# EAGLE design GW Alarm-v2 (EAGLE 6.6.0)
AUTHOR: Steven O'Shea; COMPANY: IGR; DATE: 2019-10-08; DESCRIPTION: Gravitational Wave Detection Alarm System; REVISION: 2019-10-08; TITLE: GW ALARM

## Sheet 1 of 4
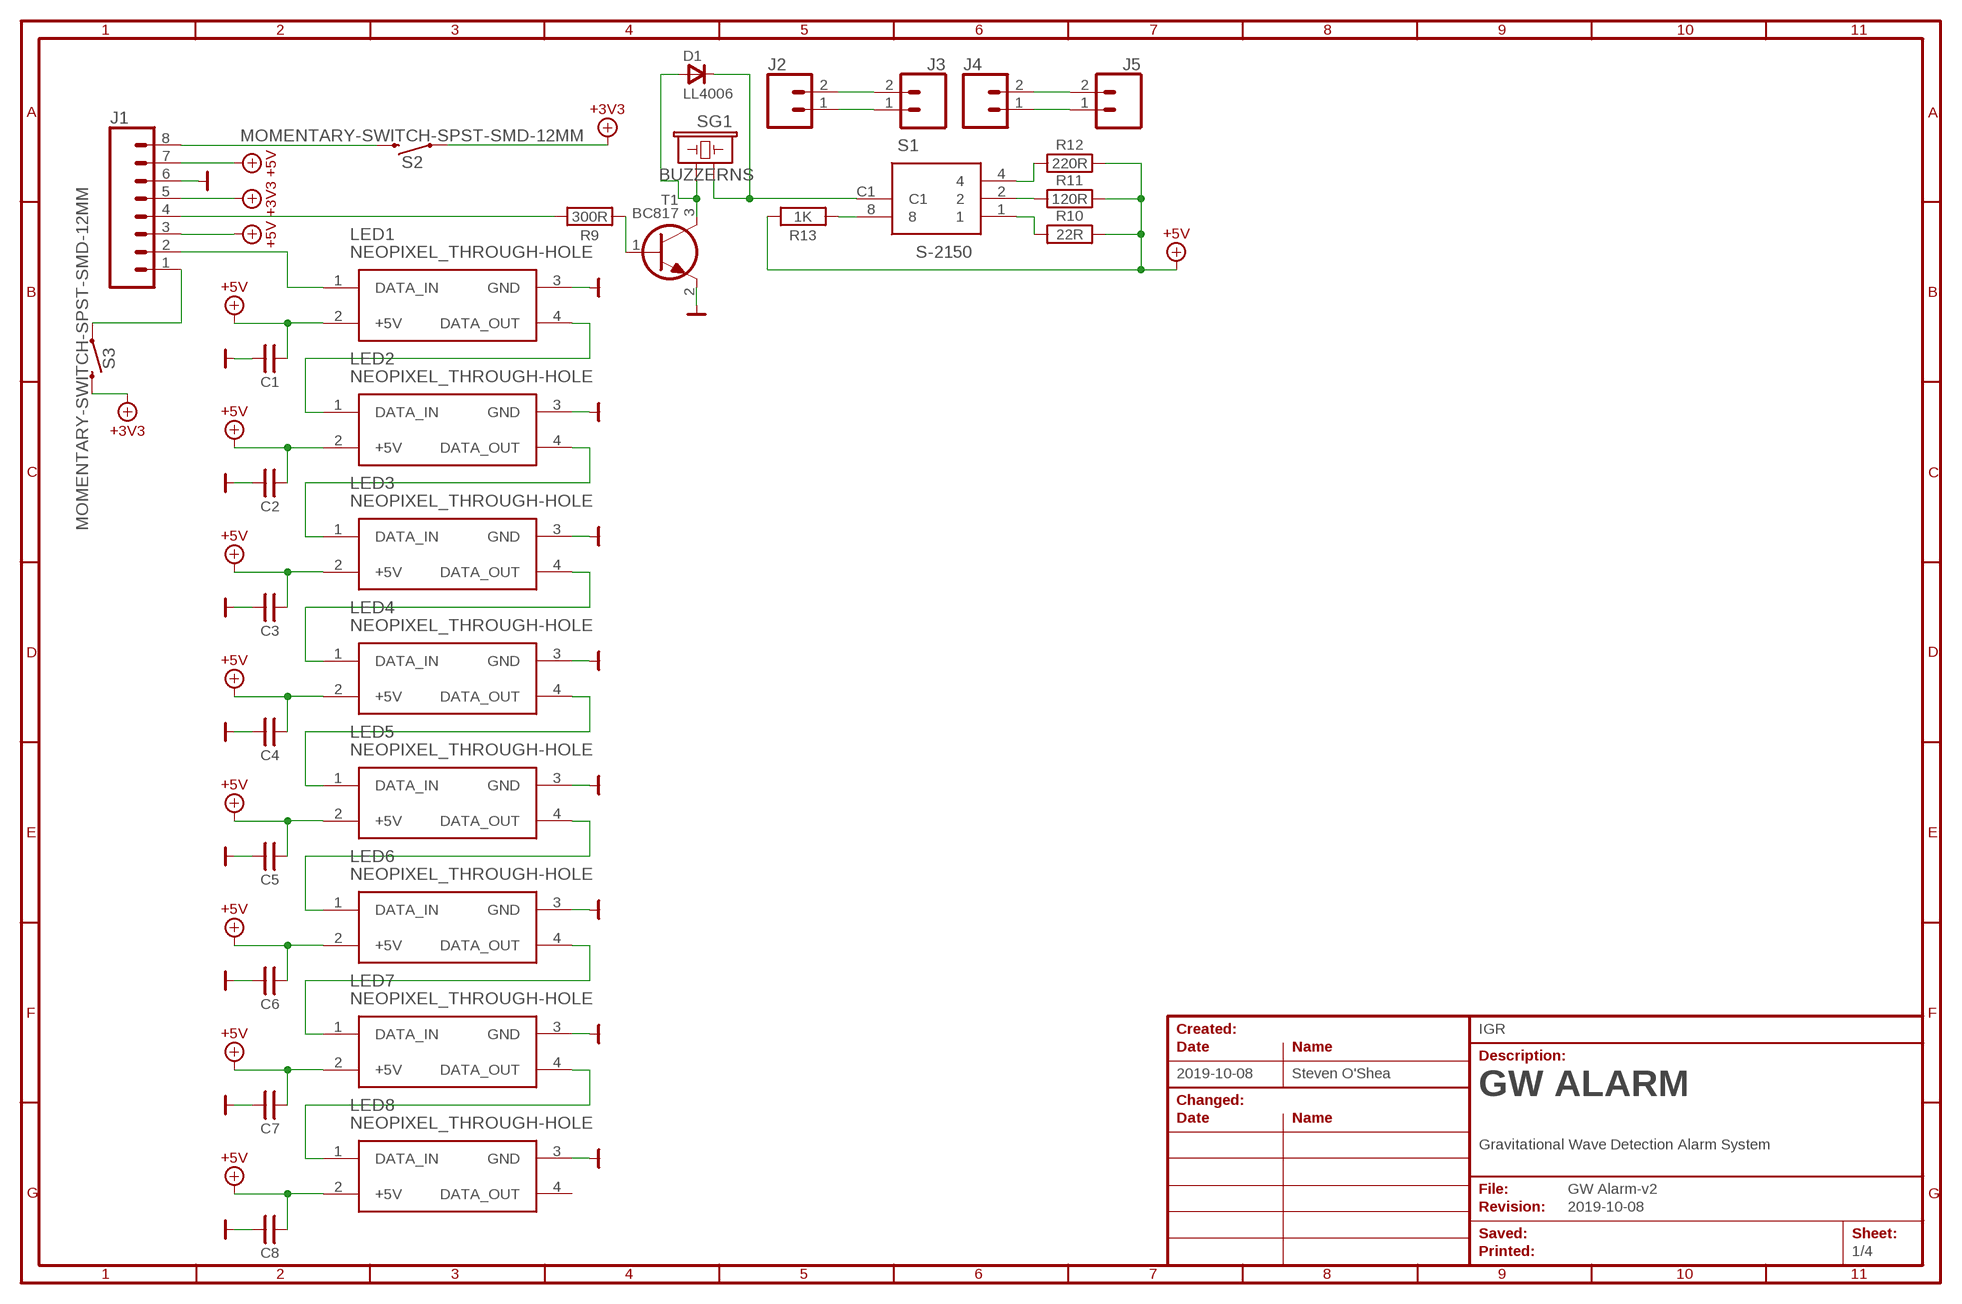
[diagram p0: schematic, sheet 1]
$1 (FRAME-A4-LANDSCAPE): SPICE: <ignore>

### Parts
C1  C1206  [C1206]
C2  C1206  [C1206]
C3  C1206  [C1206]
C4  C1206  [C1206]
C5  C1206  [C1206]
C6  C1206  [C1206]
C7  C1206  [C1206]
C8  C1206  [C1206]
D1  LL4006  DMELF  [DMELF-VALUE]
J1  CONN_083.5MM-8  [SCREWTERMINAL-3.5MM-8]
J2  CONN_023.5MM  [SCREWTERMINAL-3.5MM-2]
J3  CONN_02LOCK_LONGPADS  [1X02_LOCK_LONGPADS]
J4  CONN_023.5MM  [SCREWTERMINAL-3.5MM-2]
J5  CONN_02LOCK_LONGPADS  [1X02_LOCK_LONGPADS]
LED1  NEOPIXEL_THROUGH-HOLE  [NEOPIXEL_THROUGH-HOLE]
LED2  NEOPIXEL_THROUGH-HOLE  [NEOPIXEL_THROUGH-HOLE]
LED3  NEOPIXEL_THROUGH-HOLE  [NEOPIXEL_THROUGH-HOLE]
LED4  NEOPIXEL_THROUGH-HOLE  [NEOPIXEL_THROUGH-HOLE]
LED5  NEOPIXEL_THROUGH-HOLE  [NEOPIXEL_THROUGH-HOLE]
LED6  NEOPIXEL_THROUGH-HOLE  [NEOPIXEL_THROUGH-HOLE]
LED7  NEOPIXEL_THROUGH-HOLE  [NEOPIXEL_THROUGH-HOLE]
LED8  NEOPIXEL_THROUGH-HOLE  [NEOPIXEL_THROUGH-HOLE]
R9  300R  R1206  [R1206]
R10  22R  R1206  [R1206]
R11  120R  R1206  [R1206]
R12  220R  R1206  [R1206]
R13  1K  R1206  [R1206]
S1  S-2150  [S2150]
S2  MOMENTARY-SWITCH-SPST-SMD-12MM  [TACTILE_SWITCH_SMD_12MM]
S3  MOMENTARY-SWITCH-SPST-SMD-12MM  [TACTILE_SWITCH_SMD_12MM]
SG1  BUZZERNS  [BUZZER-12MM-NS]
T1  BC817  BC817S  [SOT23]

### Nets
+3V3: J1.5 S2.1 S3.3 ; supply symbol labelled V+3V3
+5V: C1.1 C2.1 C3.1 C4.1 C5.1 C6.1 C7.1 C8.1 J1.3 J1.7 LED1.2(+5V) LED2.2(+5V) LED3.2(+5V) LED4.2(+5V) LED5.2(+5V) LED6.2(+5V) LED7.2(+5V) LED8.2(+5V) R10.2 R11.2 R12.2 R13.2 ; supply symbol labelled V+5V
GND: C1.2 C2.2 C3.2 C4.2 C5.2 C6.2 C7.2 C8.2 J1.6 LED1.3(GND) LED2.3(GND) LED6.3(GND) LED8.3(GND) T1.2(E) ; supply symbol labelled VG
N$1: D1.A SG1.- T1.3(C)
N$2: R9.1 T1.1(B)
N$3: R10.1 S1.1
N$4: R11.1 S1.2
N$5: R12.1 S1.4
N$6: R13.1 S1.8
N$7: LED1.4(DATA_OUT) LED2.1(DATA_IN)
N$8: LED2.4(DATA_OUT) LED3.1(DATA_IN)
N$9: LED3.4(DATA_OUT) LED4.1(DATA_IN)
N$10: LED4.4(DATA_OUT) LED5.1(DATA_IN)
N$11: LED5.4(DATA_OUT) LED6.1(DATA_IN)
N$12: LED6.4(DATA_OUT) LED7.1(DATA_IN)
N$13: LED7.4(DATA_OUT) LED8.1(DATA_IN)
N$14: J1.2 LED1.1(DATA_IN)
N$16: J1.4 R9.2
N$22: D1.C S1.C1 SG1.+
N$24: J1.1 S3.1
N$26: J1.8 S2.3
N$28: J2.1 J3.1
N$29: J2.2 J3.2
N$30: J4.1 J5.1
N$31: J4.2 J5.2
Unconnected: LED8.4(DATA_OUT)

## Sheet 2 of 4
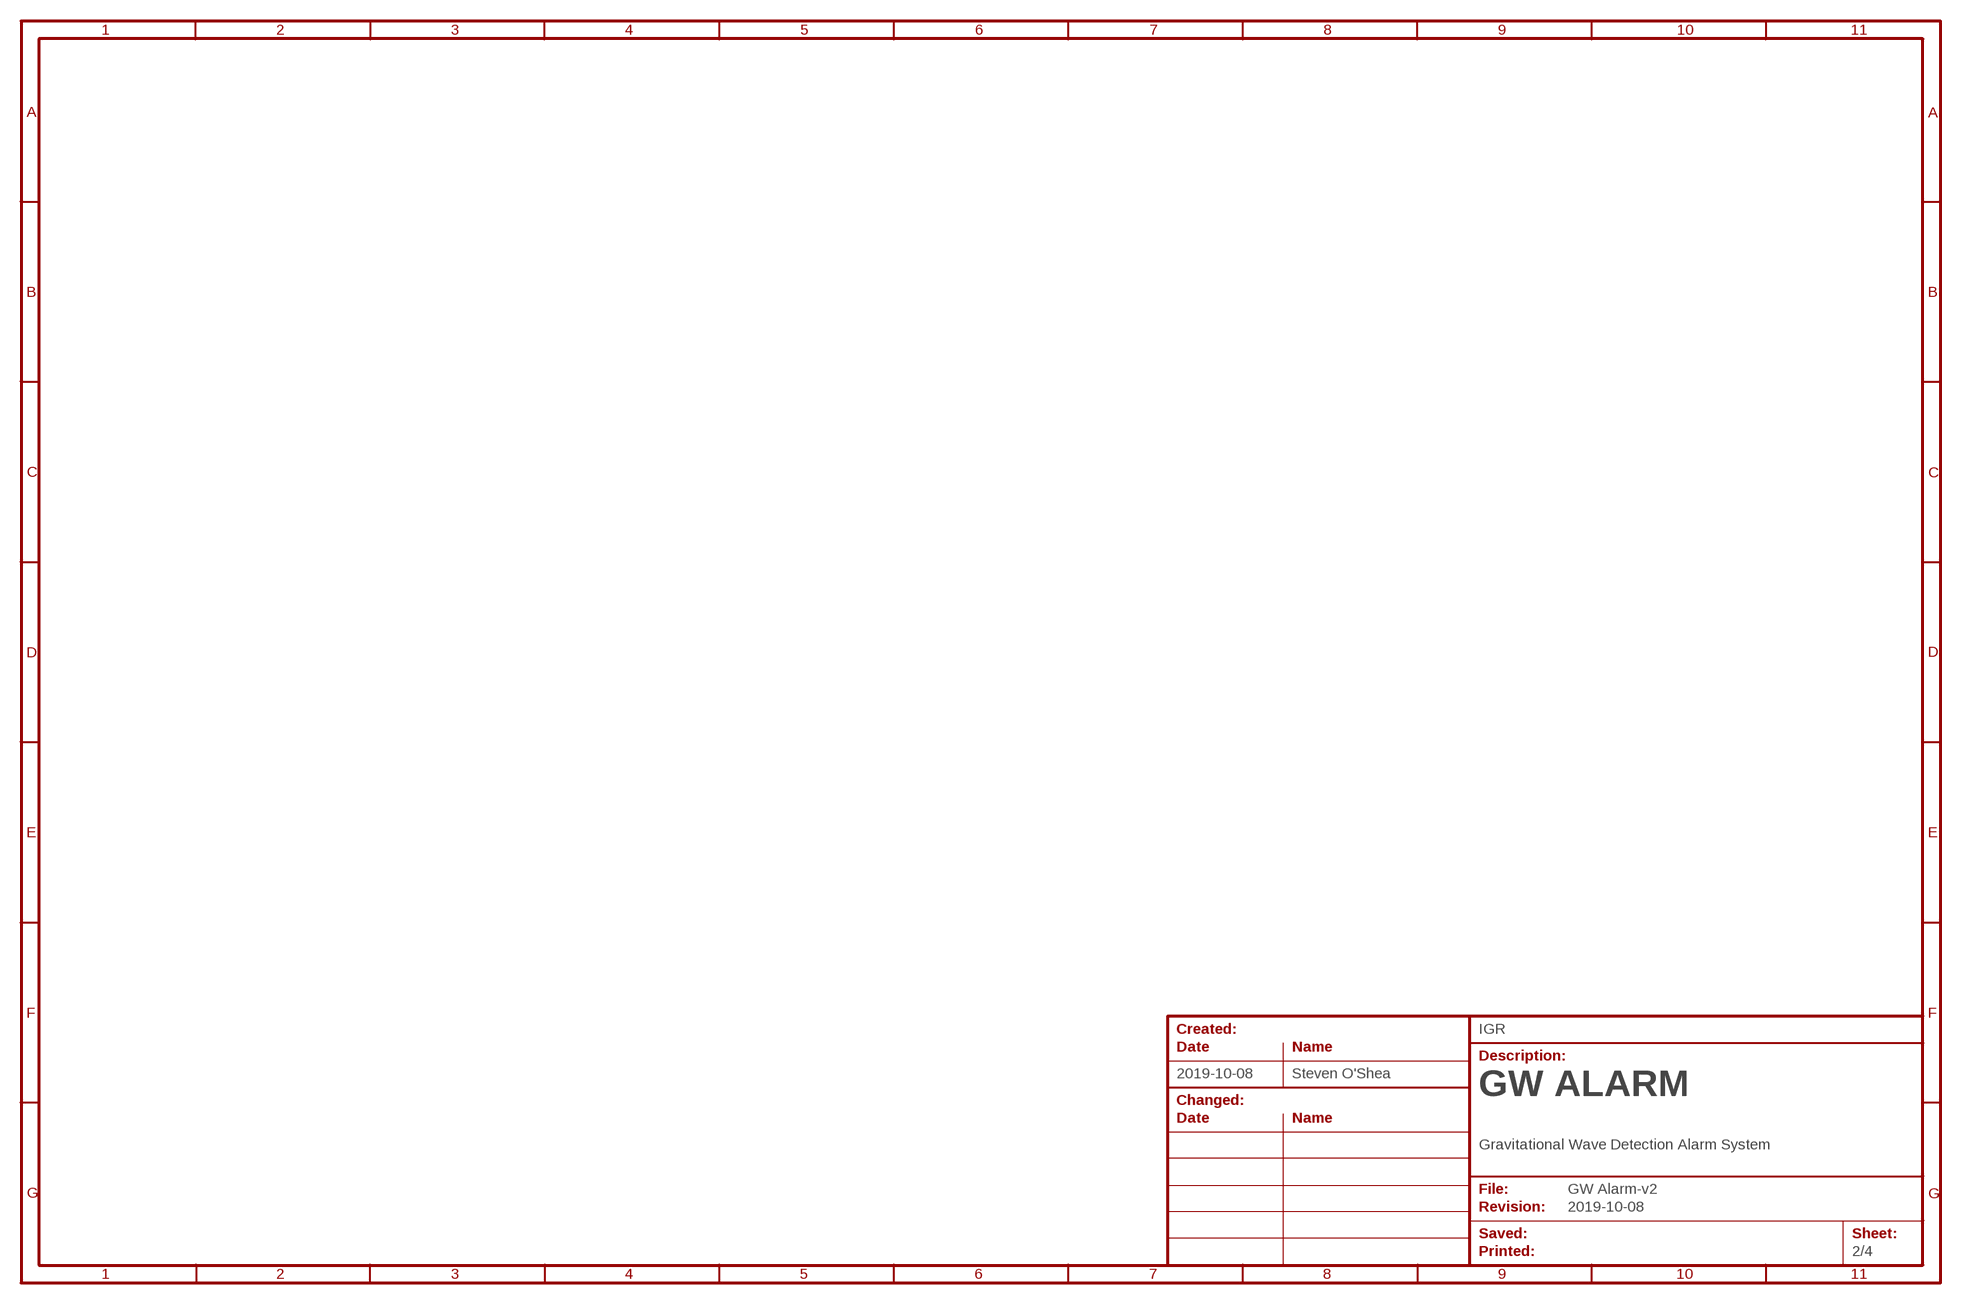
[diagram p1: schematic, sheet 2]
$2 (FRAME-A4-LANDSCAPE): SPICE: <ignore>

## Sheet 3 of 4
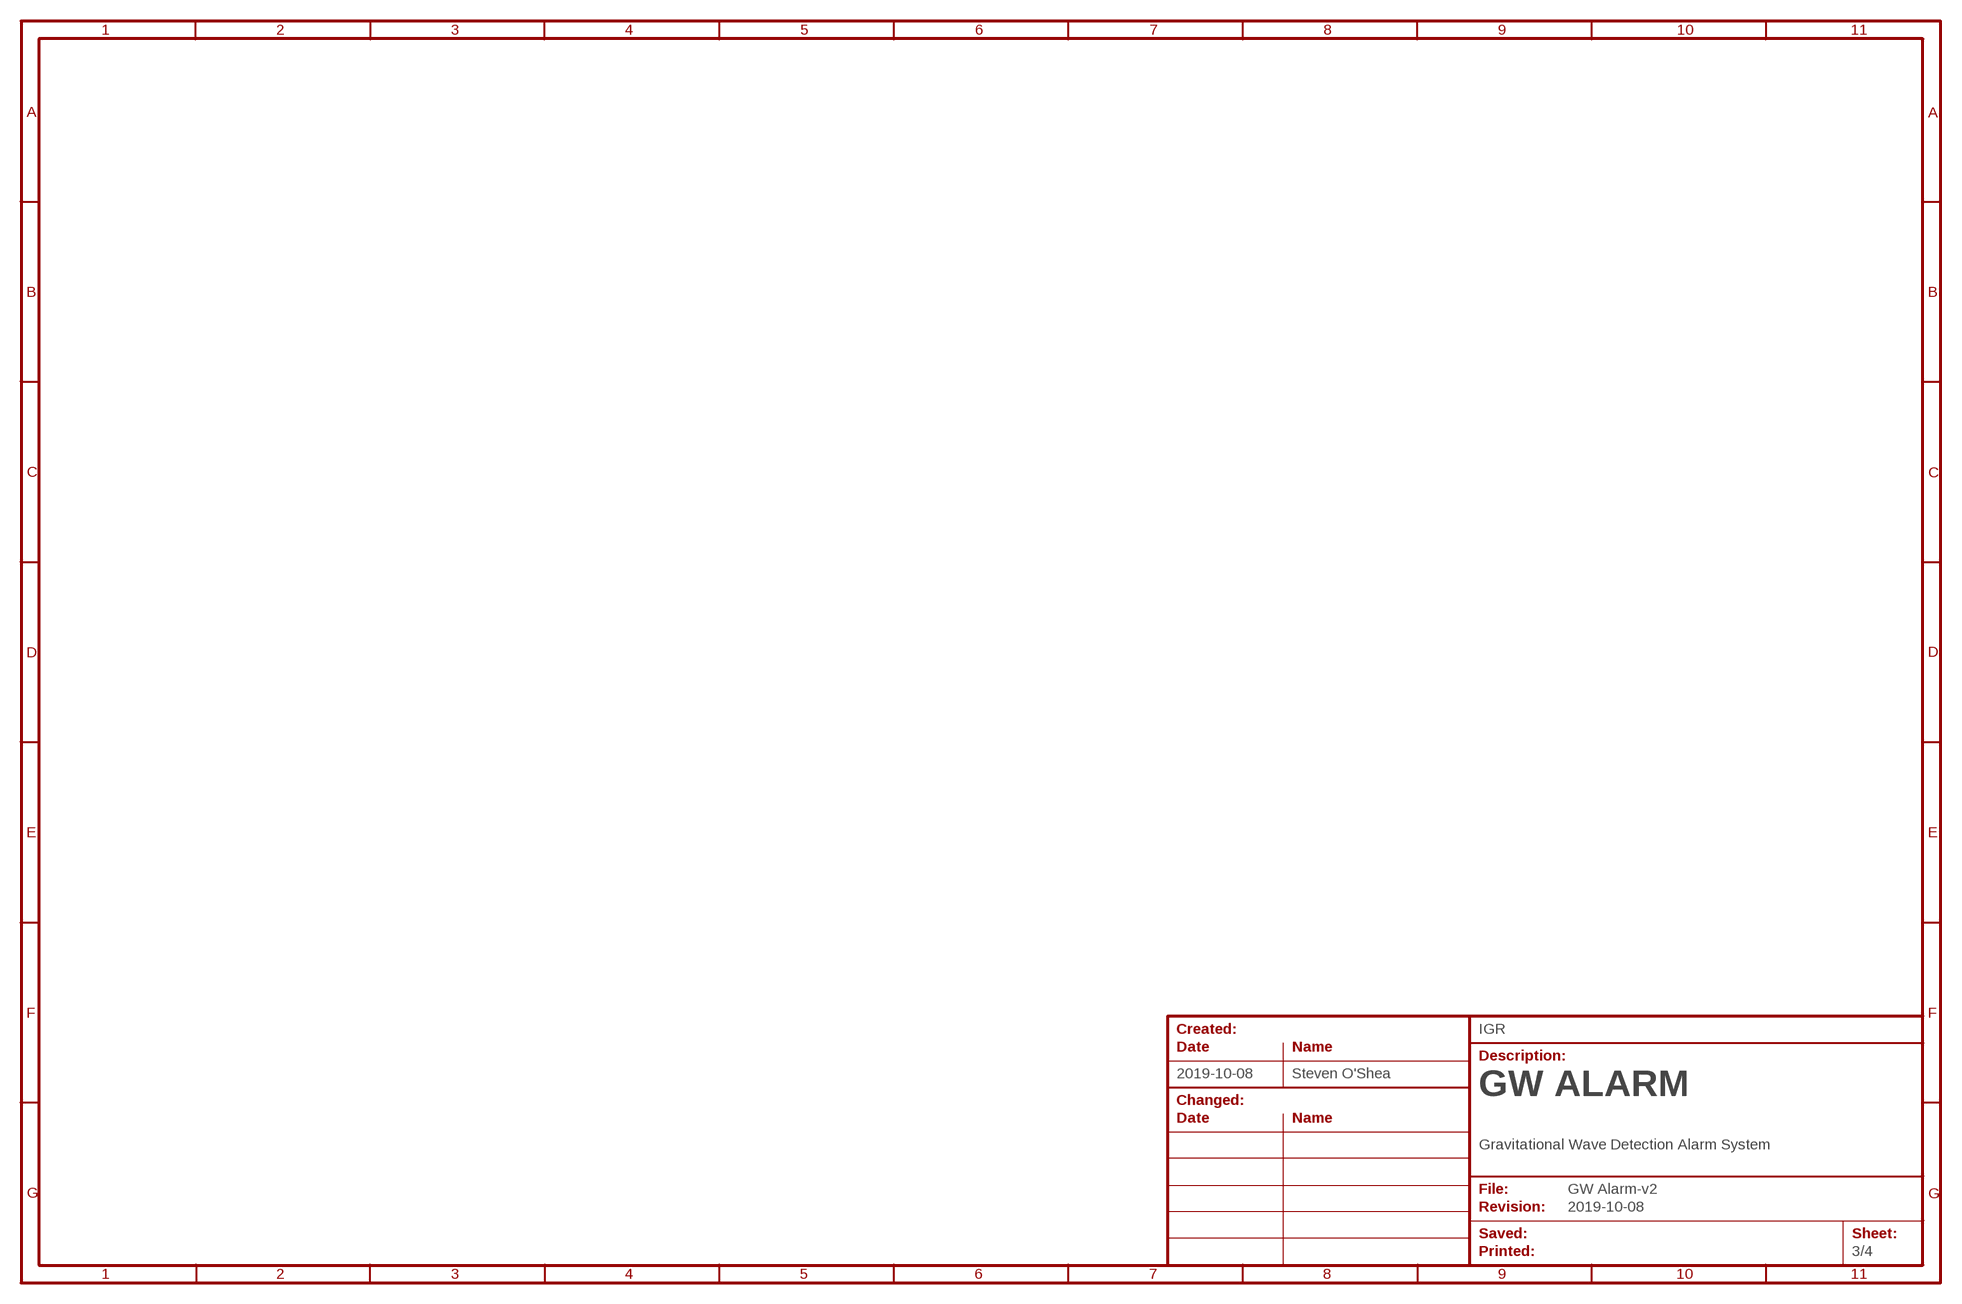
[diagram p2: schematic, sheet 3]
$3 (FRAME-A4-LANDSCAPE): SPICE: <ignore>

## Sheet 4 of 4
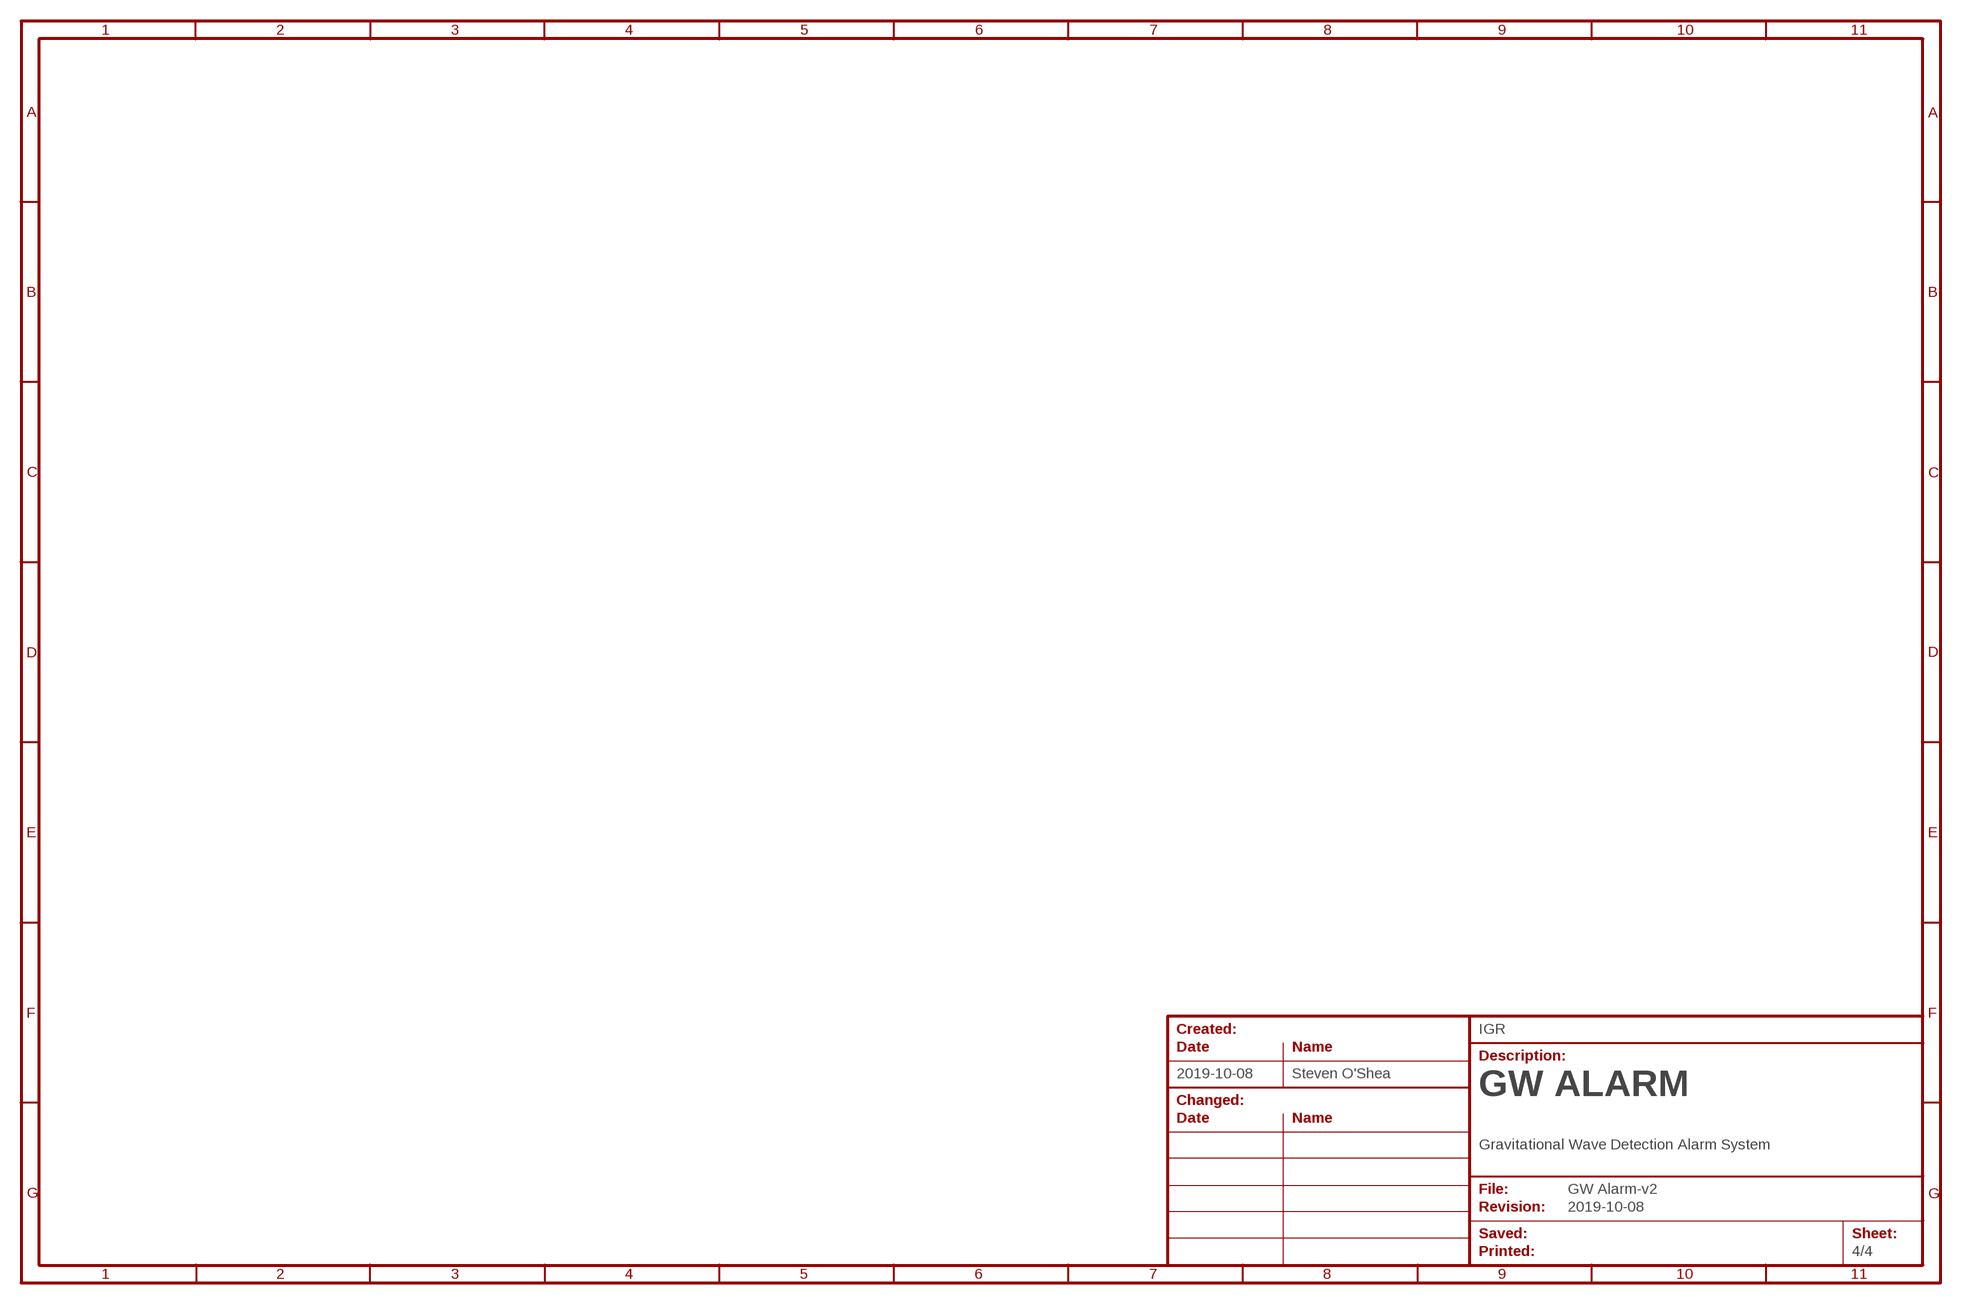
[diagram p3: schematic, sheet 4]
$4 (FRAME-A4-LANDSCAPE): SPICE: <ignore>

## Power pins joined to a net without a drawn wire
GND: LED3.3(GND) LED4.3(GND) LED5.3(GND) LED7.3(GND)

## Library data of the parts
C1-C8 = miscs:C: Capacitor, bipolar _____ Supported SPICE attributes: VALUE, VOLTAGE, CPARALLEL, LSERIES, RLSHUNT, RPARALLEL, RSERIES (A detailed description of these parameters can be found in the library spice.lbr) _____ References (PDF files, electronics workshop server): WIMA FKP 02 <http://elektronik.aei.uni-hannover.de:3000/datasheets/capacitors/wima-fkp02.pdf> (polypropylene film capacitors, 0.1" spacing) WIMA FKP 2 <http://elektronik.aei.uni-hannover.de:3000/datasheets/capacitors/wima-fkp2.pdf> (polypropylene film capacitors, 0.2" spacing) WIMA FKS 2 <http://elektronik.aei.uni-hannover.de:3000/datasheets/capacitors/wima-fks2.pdf> (polyester film capacitors, 0.2" spacing) WIMA MKP 2 <http://elektronik.aei.uni-hannover.de:3000/datasheets/capacitors/wima-mkp2.pdf> (polypropylene film capacitors, 0.2" spacing) WIMA MKS 02 <http://elektronik.aei.uni-hannover.de:3000/datasheets/capacitors/wima-mks02.pdf> (polyester film capacitors, 0.1" spacing) WIMA MKS 2 <http://elektronik.aei.uni-hannover.de:3000/datasheets/capacitors/wima-mks2.pdf> (polyester film capacitors, 0.2" spacing) Kemet ceramics <http://elektronik.aei.uni-hannover.de:3000/datasheets/capacitors/kemet-ceramics.pdf> (multilayer ceramic leaded capacitors) Vishay ceramics HV <http://elektronik.aei.uni-hannover.de:3000/datasheets/capacitors/vishay-ceramic-hv.pdf> (multilayer ceramic leaded capacitors, high voltage) LCR polystyrene <http://elektronik.aei.uni-hannover.de:3000/datasheets/capacitors/lcr-polystyrene.pdf> (polystyrene radial capacitors, 0.2" spacing); SPICE: <IDEALMODEL>\n<name:C> <pin:A.1> <pin:A.2> <autovalue><voltage: ic=>\n\n<REALMODEL>\n<name:C> <pin:A.1> <pin:A.2> <autovalue><voltage: ic=><rseries: rser=><lseries: lser=><rparallel: rpar=><cparallel: cpar=><rlshunt: rlshunt=>
D1 = diodes:D: Diode _____ Supported SPICE attributes: VALUE, TEMPERATURE (A detailed description of these parameters can be found in the library spice.lbr); SPICE: <name:D> <pin:A.A> <pin:A.C> <model:<value>><temperature: temp=>
J1 = SparkFun-Connectors:CONN_08: Multi connection point. Often used as Generic Header-pin footprint for 0.1 inch spaced/style header connections On any of the 0.1 inch spaced packages, you can populate with these: Break Away Headers - Straight <https://www.sparkfun.com/products/116> (PRT-00116) Break Away Male Headers - Right Angle <https://www.sparkfun.com/products/553> (PRT-00553) Female Headers <https://www.sparkfun.com/products/115> (PRT-00115) Break Away Headers - Machine Pin <https://www.sparkfun.com/products/117> (PRT-00117) Break Away Female Headers - Swiss Machine Pin <https://www.sparkfun.com/products/743> (PRT-00743) Arduino Stackable Header - 8 Pin <https://www.sparkfun.com/products/9279> (PRT-09279) For SCREWTERMINALS and SPRING TERMINALS visit here: Screw Terimnals on SparkFun.com <https://www.sparkfun.com/search/results?term=Screw+Terminals> (5mm/3.5mm/2.54mm spacing) This device is also useful as a general connection point to wire up your design to another part of your project. Our various solder wires solder well into these plated through hole pads. Hook-Up Wire - Assortment (Stranded, 22 AWG) <https://www.sparkfun.com/products/11375> (PRT-11375) Hook-Up Wire - Assortment (Solid Core, 22 AWG) <https://www.sparkfun.com/products/11367> (PRT-11367) View the entire wire category on our website here <https://www.sparkfun.com/categories/141> Special notes: Molex polarized connector foot print use with SKU : PRT-08231 with associated crimp pins and housings. 1MM SMD Version SKU: PRT-10208 NOTES ON THE VARIANTS LOCK and LOCK_LONGPADS... This footprint was designed to help hold the alignment of a through-hole component (i.e. 6-pin header) while soldering it into place. You may notice that each hole has been shifted either up or down by 0.005 of an inch from it's more standard position (which is a perfectly straight line). This slight alteration caused the pins (the squares in the middle) to touch the edges of the holes. Because they are alternating, it causes a "brace" to hold the component in place. 0.005 has proven to be the perfect amount of "off-center" position when using our standard breakaway headers. Although looks a little odd when you look at the bare footprint, once you have a header in there, the alteration is very hard to notice. Also,if you push a header all the way into place, it is covered up entirely on the bottom side.
J2 J4 = SparkFun-Connectors:CONN_02: Multi connection point. Often used as Generic Header-pin footprint for 0.1 inch spaced/style header connections On any of the 0.1 inch spaced packages, you can populate with these: Break Away Headers - Straight <https://www.sparkfun.com/products/116> (PRT-00116) Break Away Male Headers - Right Angle <https://www.sparkfun.com/products/553> (PRT-00553) Female Headers <https://www.sparkfun.com/products/115> (PRT-00115) Break Away Headers - Machine Pin <https://www.sparkfun.com/products/117> (PRT-00117) Break Away Female Headers - Swiss Machine Pin <https://www.sparkfun.com/products/743> (PRT-00743) For SCREWTERMINALS and SPRING TERMINALS visit here: Screw Terimnals on SparkFun.com <https://www.sparkfun.com/search/results?term=Screw+Terminals> (5mm/3.5mm/2.54mm spacing) This device is also useful as a general connection point to wire up your design to another part of your project. Our various solder wires solder well into these plated through hole pads. Hook-Up Wire - Assortment (Stranded, 22 AWG) <https://www.sparkfun.com/products/11375> (PRT-11375) Hook-Up Wire - Assortment (Solid Core, 22 AWG) <https://www.sparkfun.com/products/11367> (PRT-11367) View the entire wire category on our website here <https://www.sparkfun.com/categories/141> Special notes: Molex polarized connector foot print use with: PRT-08233 with associated crimp pins and housings. 2.54_SCREWTERM for use with PRT-10571. 3.5mm Screw Terminal footprints for PRT-08084 5mm Screw Terminal footprints for use with PRT-08432; PROD_ID: CONN-08399
J3 J5 = SparkFun-Connectors:CONN_02: Multi connection point. Often used as Generic Header-pin footprint for 0.1 inch spaced/style header connections On any of the 0.1 inch spaced packages, you can populate with these: Break Away Headers - Straight <https://www.sparkfun.com/products/116> (PRT-00116) Break Away Male Headers - Right Angle <https://www.sparkfun.com/products/553> (PRT-00553) Female Headers <https://www.sparkfun.com/products/115> (PRT-00115) Break Away Headers - Machine Pin <https://www.sparkfun.com/products/117> (PRT-00117) Break Away Female Headers - Swiss Machine Pin <https://www.sparkfun.com/products/743> (PRT-00743) For SCREWTERMINALS and SPRING TERMINALS visit here: Screw Terimnals on SparkFun.com <https://www.sparkfun.com/search/results?term=Screw+Terminals> (5mm/3.5mm/2.54mm spacing) This device is also useful as a general connection point to wire up your design to another part of your project. Our various solder wires solder well into these plated through hole pads. Hook-Up Wire - Assortment (Stranded, 22 AWG) <https://www.sparkfun.com/products/11375> (PRT-11375) Hook-Up Wire - Assortment (Solid Core, 22 AWG) <https://www.sparkfun.com/products/11367> (PRT-11367) View the entire wire category on our website here <https://www.sparkfun.com/categories/141> Special notes: Molex polarized connector foot print use with: PRT-08233 with associated crimp pins and housings. 2.54_SCREWTERM for use with PRT-10571. 3.5mm Screw Terminal footprints for PRT-08084 5mm Screw Terminal footprints for use with PRT-08432
LED1-LED8 = Neopixel [5mm & 8mm through-hole]:NEOPIXEL_THROUGH-HOLE: _____ References: - PDF datasheet <https://cdn.sparkfun.com/datasheets/Components/LED/COM-12877.pdf> (Sparkfun datasheet) - PDF datasheet <https://cdn-shop.adafruit.com/product-files/1138/SK6812+LED+datasheet+.pdf> (Adafruit datasheet) - PDF datasheet <https://cdn-shop.adafruit.com/datasheets/WS2812.pdf> (Adafruit datasheet) - Farnell link <https://onecall.farnell.com/adafruit/1938/neopixel-5mm-thru-hole-diffuse/dp/MK00280> (5mm version) - Farnell link <https://onecall.farnell.com/adafruit/1734/neopixel-8mm-thru-hole-diffuse/dp/MK00281> (8mm version)
R9-R13 = miscs:R: Resistor, European symbol _____ Supported SPICE attributes: VALUE (A detailed description of these parameters can be found in the library spice.lbr); SPICE: <name:R> <pin:A.1> <pin:A.2> <autovalue>
S1 = S-2150:S-2150: Copal Electronics S-2050, 4 Position SP4T Rotary Switch, 100 mA, Solder Source: Datasheet <https://www.nidec-copal-electronics.com/e/catalog/switch/ss-10&s-2050.pdf>; DESCRIPTION: Copal Electronics S-2050, 4 Position SP4T Rotary Switch, 100 mA, Solder; HEIGHT: 7mm; MANUFACTURER_NAME: Copal Electronics; MANUFACTURER_PART_NUMBER: S-2150; RS_PART_NUMBER: 1796748; RS_PRICE-STOCK: http://uk.rs-online.com/web/p/products/1796748
S2 S3 = SparkFun-Switches:MOMENTARY-SWITCH-SPST: Momentary Switch (Pushbutton) - SPST Normally-open (NO) SPST momentary switches (buttons, pushbuttons). Variants PTH-12MM - 12mm square, through-hole Momentary Pushbutton Switch - 12mm Square <https://www.sparkfun.com/products/9190> (COM-09190) PTH-6.0MM, PTH-6.0MM-KIT - 6.0mm square, through-hole Mini Pushbutton Switch <https://www.sparkfun.com/products/97> (COM-00097) KIT package intended for soldering kit's - only one side of pads' copper is exposed. PTH-RIGHT-ANGLE-KIT - Right-angle, through-hole Right Angle Tactile Button <https://www.sparkfun.com/products/10791> - Used on SparkFun BigTime Watch Kit <https://www.sparkfun.com/products/11734> SMD-12MM - 12mm square, surface-mount Tactile Button - SMD (12mm) <https://www.sparkfun.com/products/12993> (COM-12993) Used on SparkFun PicoBoard <https://www.sparkfun.com/products/11888> SMD-4.5MM - 4.5mm Square Trackball Switch Used on SparkFun Blackberry Trackballer Breakout <https://www.sparkfun.com/products/13169> SMD-4.6MMX2.8MM - 4.60mm x 2.80mm, surface mount Used on SparkFun SAMD21 Mini Breakout <https://www.sparkfun.com/products/13664> SMD-5.2MM, SMD-5.2-REDUNDANT - 5.2mm square, surface-mount Mini Pushbutton Switch - SMD <https://www.sparkfun.com/products/8720> (COM-08720) Used on Arduino Pro Mini <https://www.sparkfun.com/products/11114> REDUNDANT package connects both switch circuits together SMD-6.0X3.5MM - 6.0 x 3.5mm, surface mount Momentary Reset Switch SMD <https://www.sparkfun.com/products/8229> (COM-08229) SMD-6.2MM-TALL - 6.2mm square, surface mount Tactile Button - SMD (6mm) <https://www.sparkfun.com/products/12992> Used on SparkFun Digital Sandbox <https://www.sparkfun.com/products/12651> SMD-RIGHT-ANGLE - Right-angle, surface mount Used on SparkFun Block for Intel® Edison - Arduino <https://www.sparkfun.com/products/13036>; PROD_ID: SWCH-11967; SF_SKU: COM-12993
SG1 = SparkFun:BUZZER: Buzzer 12mm Spark Fun Electronics SKU : Comp-Buzzer
T1 = transistors:BC817: BC817: Universal NPN transistor (Philips, Fairchild,...) 45V Uce, 500mA Ic, 100-600 hfe _____ References: - PDF datasheet <http://elektronik.aei.uni-hannover.de:3000/datasheets/transistors/bipolar/npn/bc817.pdf> (electronics workshop server) - Manufacturer's link <http://www.fairchildsemi.com/pf/BC/BC817.html?rd=Y> (Fairchild website) - Internet search <http://www.google.de/search?q=bc817> (Google results)

## Board
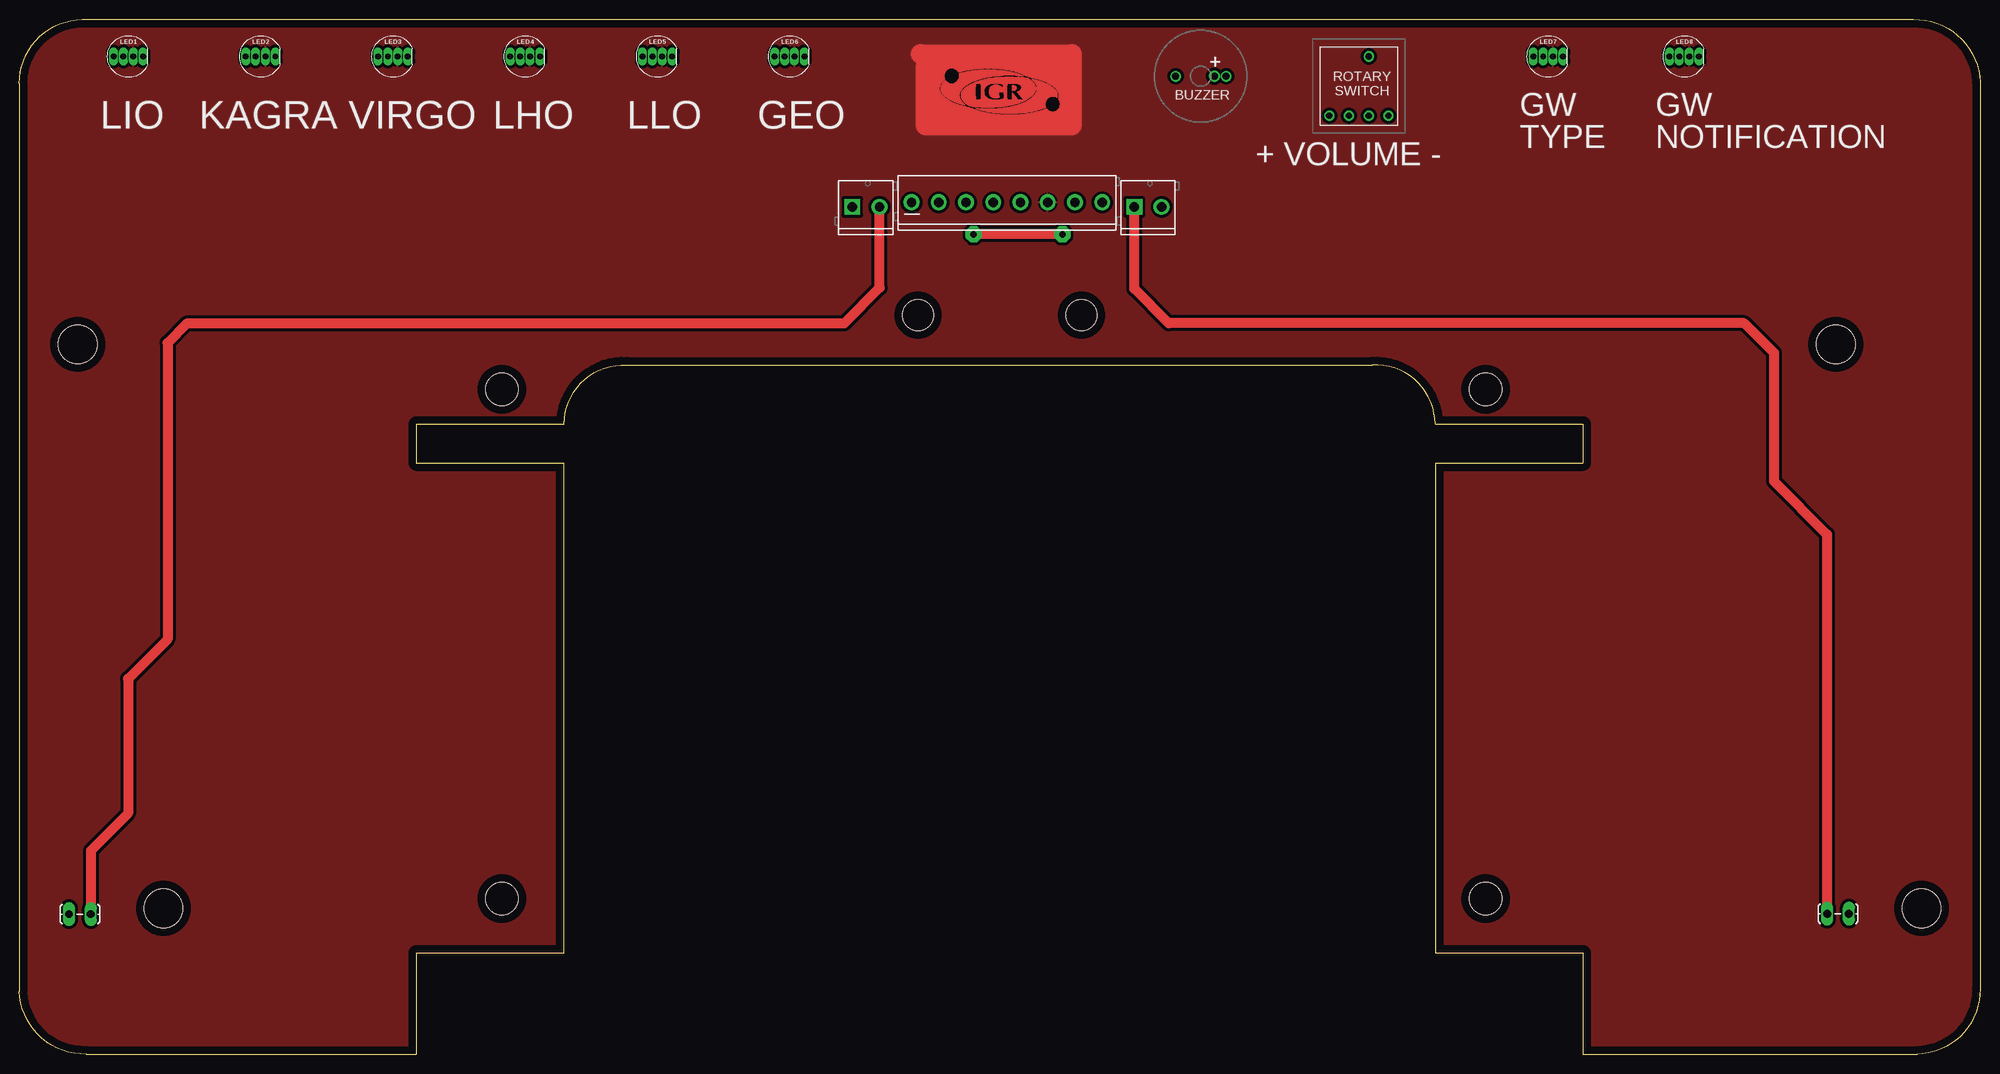
[diagram p4: board, top side]
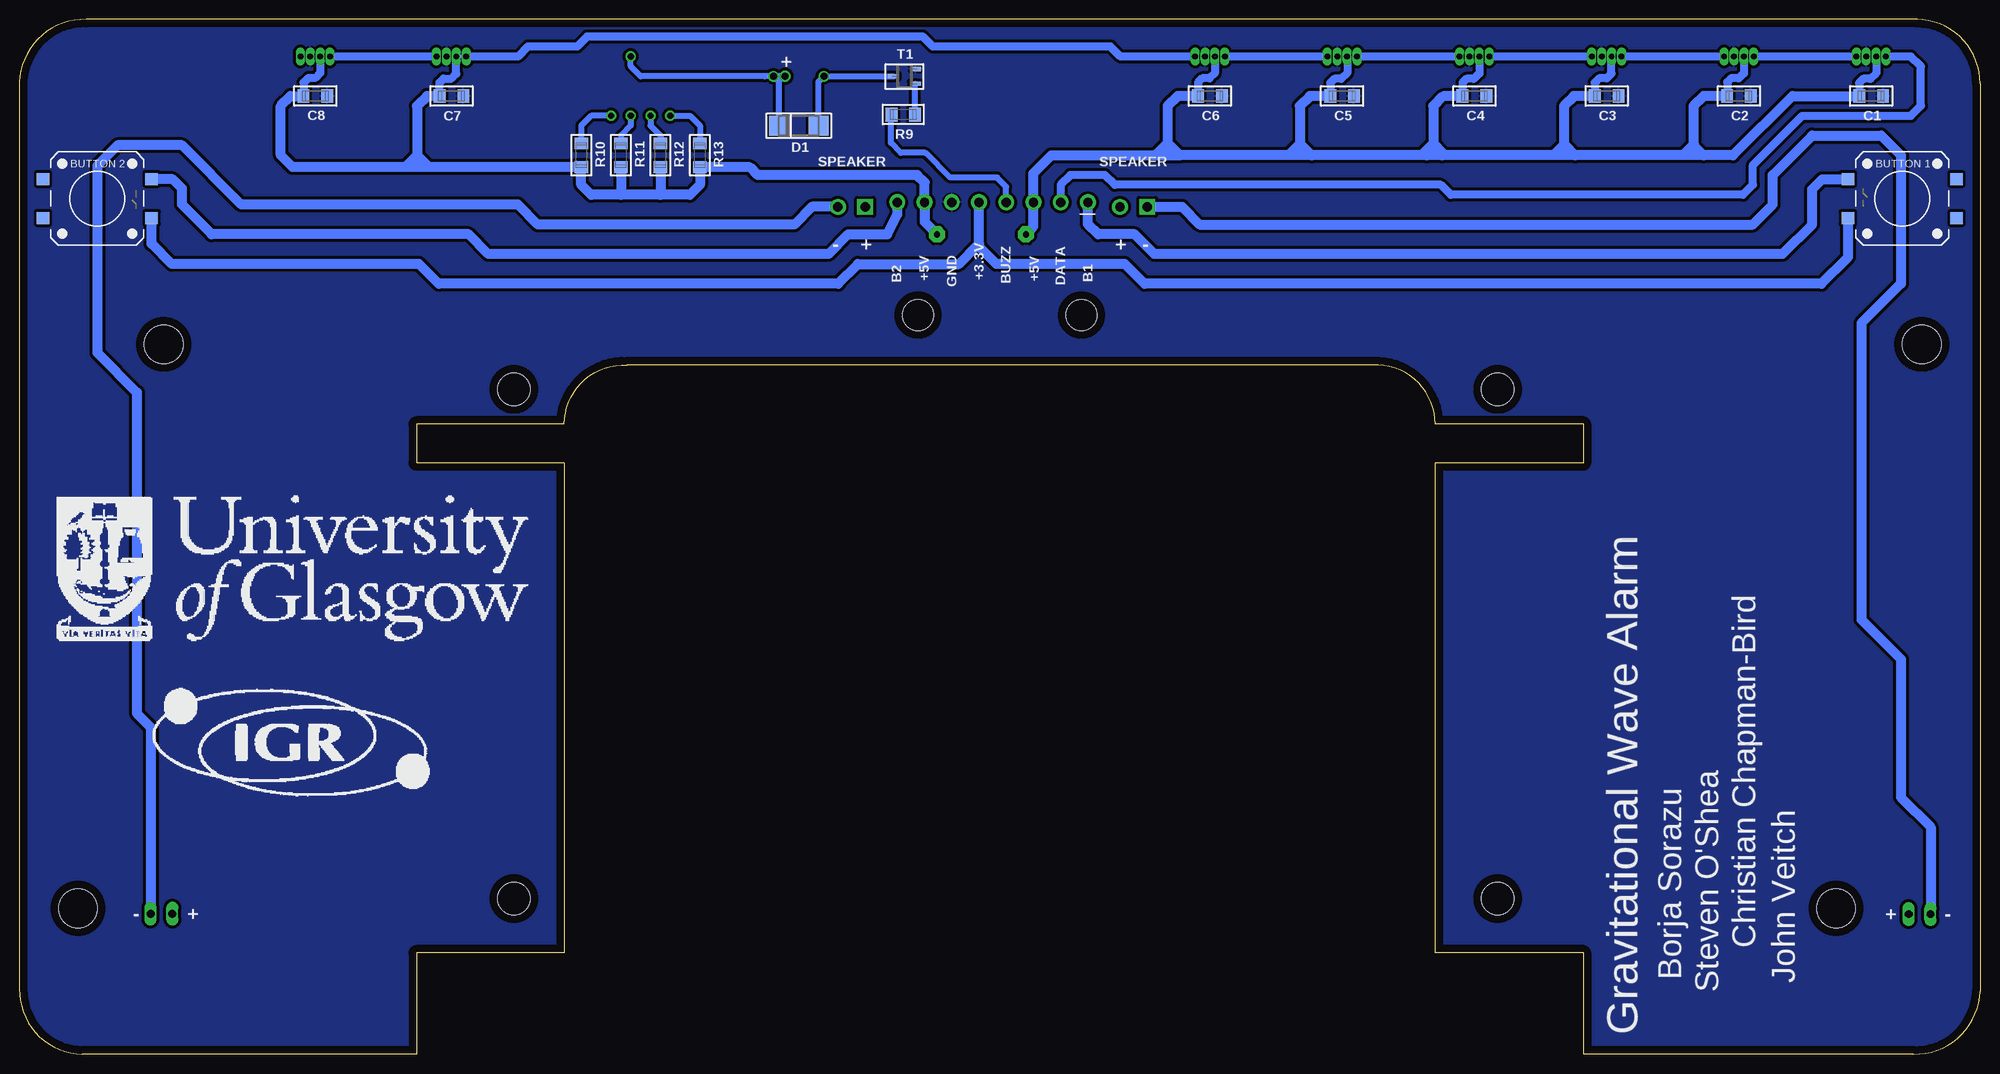
[diagram p5: board, bottom side, seen from below]

Size 252.03 x 133.03 mm. Coordinates in mm from the lower left corner, seen from the top.
Outline: 8.57,0 51,0 51,13 70.01,13 70.01,76 51,76 51,81 70.01,81 arc-93 78.09,88.59 173.9,88.59 arc-93 181.99,81 201,81 201,76 182,76 182,70 182,13 201,13 201,0 243.94,0 arc90 252.03,8.41 252.03,124.94 arc90 243.43,133.03 8.1,133.03 arc90 0,124.78 0,8.1 arc90 8.57,0
Copper layers (1*16): Top 0.035mm / dielectric 1.5mm / Bottom 0.035mm
Design rules "default *": minimum track width 10mil, minimum drill 24mil, track to track 8mil, track to pad 8mil, pad to pad 8mil, via to via 8mil, smd to smd 8mil, copper to edge 40mil, drill to drill 8mil, minimum pad ring 1mil, minimum via ring 1mil, stop-mask expansion 0.2mm, vias tented up to drill 0mil, thermal gap 10mil
Holes 4.2 mm at 62,20 62,85.5 188.5,85.5 188.5,20
Holes 5 mm at 18.5,18.75 7.5,91.25 244.5,18.75 233.5,91.25
Holes 4 mm at 115.52,95 136.52,95

### Footprints (pad centres in the part's own frame; a part is rotated, then mirrored left to right if it is on the bottom)
C1206 = smd 1.524 x 1.778: 1 -1.529,0; 2 1.529,0
DMELF-VALUE = smd 2.54 x 2.54: A -2.54,0; C 2.54,0
SCREWTERMINAL-3.5MM-8 = drill 1.2 pad 2.032: 1 0,0; 2 3.5,0; 3 7,0; 4 10.5,0; 5 14,0; 6 17.5,0; 7 21,0; 8 24.5,0
SCREWTERMINAL-3.5MM-2 = drill 1.2 pad 2.032 square: 1 0,0 | drill 1.2 pad 2.032: 2 3.5,0
1X02_LOCK_LONGPADS = drill 1.016 long: 1 -0.127,0; 2 2.667,0
NEOPIXEL_THROUGH-HOLE = drill 0.762 pad 0.889 long: 1 -1.905,0; 2 -0.635,0; 3 0.635,0; 4 1.905,0
R1206 = smd 1.524 x 1.778: 1 -1.529,0; 2 1.529,0
S2150 = drill 0.8 pad 1.3: 1 0,0; 2 -2.54,0; 4 -5.08,0; 8 -7.62,0; C1 -2.54,7.62
TACTILE_SWITCH_SMD_12MM = smd 1.6 x 1.55: 1 6.975,-2.5; 2 -6.975,-2.5; 3 6.975,2.5; 4 -6.975,2.5
BUZZER-12MM-NS = drill 0.9: + 3.25,0; - -3.25,0
SOT23 = smd 0.55 x 1.4: 1 0.95,1.4; 2 -0.95,1.4; 3 0,-1.4

### Placement (x,y rotation side)
C1  14,123.19 0 bottom
C2  31,123.19 0 bottom
C3  48,123.19 0 bottom
C4  65,123.19 0 bottom
C5  82,123.19 0 bottom
C6  99,123.19 0 bottom
C7  196.5,123.19 0 bottom
C8  214,123.19 0 bottom
D1  151.86,119.38 180 bottom
J1  114.68,109.52 0 top
J2  107.06,108.93 0 top
J3  6.5,18 0 top
J4  143.32,108.93 0 top
J5  232.5,18.05 0 top
LED1  14,128.27 0 top
LED2  31,128.27 0 top
LED3  48,128.27 0 top
LED4  65,128.27 0 top
LED5  82,128.27 0 top
LED6  99,128.27 0 top
LED7  196.5,128.27 0 top
LED8  214,128.27 0 top
R9  138.42,120.8 180 bottom
R10  179.8,115.57 270 bottom
R11  174.72,115.57 270 bottom
R12  169.64,115.57 270 bottom
R13  164.56,115.57 270 bottom
S1  175.99,120.65 0 top
S2  242.03,110 0 bottom
S3  10,110 180 bottom
SG1  151.86,125.73 0 top
T1  138.27,125.73 270 bottom
U$1  [IGRLOGO#PNG]  217.17,40.64 0 bottom
U$3  [GLASGOWUNIVERSITY#GIF]  217.17,62.23 0 bottom
U$4  [IGRLOGO#PNG]  126,124 0 top

### Tracks (layer width: path | path; a pad name or v marks a point on that pad's centre or on a via)
+3V3
  Bottom 1.27: 128.86,104 131.25,101.6 144.24,101.6 146.78,99.06 198.12,99.06 200.66,101.6 232.44,101.6 235.04,104.2 235.04,107.49 S2.1 | 128.86,104 128.68,104.17 J1.5 | 128.86,104 126.46,101.6 109.95,101.6 107.41,99.06 20.38,99.06 16.95,102.49 16.95,107.48 S3.3
+5V  (via drill 0.81 pad 2.03)  (1 unrouted)
  Top 1.27: v134.08,105.41 v122.65,105.41
  Bottom 0.406: 81.34,128.25 LED5.2 | LED4.2 | LED3.2
  Bottom 1.016: C7.1 198.03,124.9 197.52,125.41 196.5,125.41 195.87,126.05 LED7.2 | LED3.2 47.37,126.08 48.01,125.44 48.99,125.44 49.53,124.9 C3.1 | LED2.2 30.36,126.1 31.02,125.44 32.04,125.44 32.51,124.97 32.51,123.21 C2.1 | LED1.2 13.37,126.08 14.06,125.38 15.02,125.38 15.53,124.87 C1.1 | LED4.2 64.36,126.11 65.09,125.38 66.04,125.38 66.52,124.9 66.52,123.2 C4.1 | 81.34,128.25 81.34,126.14 82.11,125.38 83.03,125.38 83.53,124.87 C5.1 | LED6.2 98.36,126.11 99.03,125.44 100.01,125.44 100.52,124.94 C6.1 | LED8.2 213.37,126.17 214.03,125.51 214.92,125.51 215.52,124.9 C8.1
  Bottom 1.27: 169.64,110.49 165.83,110.49 164.56,111.76 R13.2 164.53,114.01 158.12,114.01 157.13,113.03 136.62,113.03 135.68,112.09 J1.7 135.68,107.01 v134.08,105.41 | 169.64,110.49 174.72,110.49 | 174.72,110.49 178.53,110.49 179.8,111.76 R10.2 199.39,114.04 | R12.2 169.64,110.49 | R11.2 174.72,110.49 | v122.65,105.41 122.65,105.45 121.69,106.41 121.69,109.52 J1.3 121.68,113.27 119.38,115.57 102.87,115.57 | 199.39,114.04 216.91,114.04 218.44,115.57 218.44,121.92 217.17,123.19 C8.1 | 52.07,115.57 69.12,115.57 | 69.12,115.57 71.12,115.57 | 71.12,115.57 85.95,115.57 | 85.95,115.57 102.87,115.57 | LED7.2 | C7.1 199.64,123.19 200.91,121.92 200.91,115.56 199.39,114.04 | 35.56,115.57 31.75,115.57 24.13,123.19 C1.1 | 35.56,115.57 52.07,115.57 | C2.1 35.56,123.19 36.83,121.92 36.83,116.84 35.56,115.57 | C3.1 52.23,123.19 53.5,121.92 53.5,116.84 53.34,116.84 52.07,115.57 | C4.1 69.03,123.16 70.29,121.89 70.29,117.13 | 70.29,117.13 70.29,117.03 | 70.29,116.75 70.29,116.39 71.12,115.57 | C5.1 86.17,123.19 87.44,121.92 87.44,116.84 87.22,116.84 85.95,115.57 | C6.1 103.16,123.19 104.43,121.92 104.43,117.13 | 104.43,117.13 104.43,116.84 104.14,116.84 102.87,115.57 | 70.29,116.78 70.29,116.75 | 70.29,116.75 69.12,115.57 | 70.29,116.97 70.29,116.78 | 70.29,116.78 71.37,115.7 | 70.29,117.03 70.29,116.97 | 70.29,116.97 69.03,115.7 69.03,115.76 70.29,117.03 | 70.29,117.13 71.82,115.6 | 104.43,117.13 104.49,117.13 105.89,115.73
GND
  Top 2.54: 115.89,128.59 135.25,128.59 135.25,119.38 116.52,119.38 116.52,127
  pour Top (isolate 0.381, rank 3): 0,125.73 arc-90 7.62,133.35 243.3,133.35 arc-90 252.19,124.46 252.19,8.89 arc-90 243.3,0 189.96,-1.27 arc-90 182.34,7.62 182.34,78.74 arc90 173.45,87.63 78.2,87.63 arc90 69.31,78.74 69.31,8.89 arc-90 60.42,0 8.89,0 arc-90 0,8.89
  pour Bottom (isolate 0.381, rank 3): 0,8.89 0,125.73 arc-90 7.62,133.35 243.3,133.35 arc-90 252.19,124.46 252.19,8.89 arc-90 243.3,0 189.96,-2.54 arc-90 182.34,7.62 182.34,78.74 arc90 173.45,87.63 78.2,87.63 arc90 69.31,78.74 69.31,8.89 arc-90 60.42,0 8.89,0 arc-90
N$1
  Bottom 0.635: T1.3
  Bottom 0.762: T1.3 SG1.- 149.32,125.02 D1.A
N$2
  Bottom 0.635: 136.88,124.77 T1.1
  Bottom 0.762: R9.1 136.88,124.77
N$3
  Bottom 0.762: S1.1 178.53,120.65 179.8,119.38 R10.1
N$4
  Bottom 0.762: S1.2 173.45,119.38 174.72,118.11 R11.1
N$5
  Bottom 0.762: S1.4 170.91,119.38 169.64,118.11 R12.1
N$6
  Bottom 0.762: S1.8 165.83,120.65 164.56,119.38 R13.1
N$7
  Bottom 1.016: LED1.4 LED2.1
N$8
  Bottom 1.016: LED2.4 LED3.1
N$9
  Bottom 1.016: LED3.4 LED4.1
N$10
  Bottom 1.016: LED4.4 LED5.1
N$11
  Bottom 1.016: LED5.4 LED6.1
N$12
  Bottom 1.016: LED6.4 110.49,128.27 111.76,129.54 134.62,129.54 135.89,130.81 179.07,130.81 180.34,129.54 186.69,129.54 187.96,128.27 LED7.1
N$13
  Bottom 1.016: LED7.4 LED8.1
N$14
  Bottom 1.016: J1.2 118.2,109.54 118.2,111.76 116.94,113.03 112.49,113.03 111.22,111.76 69.31,111.76 68.04,110.49 30.48,110.49 29.21,111.76 29.21,114.3 22.86,120.65 8.89,120.65 7.62,121.92 7.62,127 8.89,128.27 LED1.1
N$15
  Bottom 1.27: 200.85,115.44 201.04,115.44 202.38,114.11
N$16
  Bottom 0.762: J1.4 125.18,111.53 126.36,112.71 132.4,112.71 135.57,115.89 138.75,115.89 140.02,117.16 140.02,120.73 R9.2
N$17
  Bottom 1.27: 53.47,116.81 53.63,116.81 54.83,115.6
N$18
  Bottom 1.27: 70.33,116.52 70.33,116.46 69.47,115.6
N$19
  Bottom 1.27: 36.8,117.09 36.8,116.97 38.13,115.63
N$20
  Bottom 1.27: 70.33,117.16 70.29,117.06
N$21
  Bottom 1.27: 87.41,117.06 88.71,115.76
N$22  (via drill 0.89 pad 1.4)
  Bottom 0.762: v153.61,125.73 153.67,125.73 153.7,125.73 | 153.7,125.73 154.37,125.06 | SG1.+ 156.21,125.73 172.18,125.73 173.45,127 S1.C1 | D1.C 154.4,125.02 SG1.+ | 153.7,125.73 SG1.+
N$24
  Bottom 1.27: J1.1 114.68,106.74 113.35,105.41 108.68,105.41 106.14,102.87 25.4,102.87 21.59,106.68 21.59,111.19 20.29,112.49 S3.1
N$26
  Bottom 1.27: J1.8 139.18,107.97 140.47,105.41 145.51,105.41 148.05,102.87 191.77,102.87 194.31,105.41 227.33,105.41 231.14,109.22 231.14,111.28 232.35,112.49 235.05,112.49 S2.3
N$28
  Bottom 1.27: J3.1 6.35,18.02 6.35,29.21 10.16,33.02 10.16,50.8 15.24,55.88 15.24,93.98 10.16,99.06 10.16,115.57 12.7,118.11 21.59,118.11 26.67,113.03 26.67,109.22 29.21,106.68 100.33,106.68 102.58,108.93 J2.1
N$29
  Top 1.27: J3.2 9.18,26.16 13.97,30.96 13.97,48.26 19.05,53.34 19.05,91.44 21.59,93.98 106.05,93.98 110.58,98.52 110.58,108.91 J2.2
N$30
  Top 1.27: J5.1 232.35,18.08 232.35,66.83 225.52,73.66 225.52,90.17 221.71,93.98 147.73,93.98 143.32,98.39 J4.1
N$31
  Bottom 1.27: J5.2 235.17,42.04 236.95,43.81 236.95,85.09 242.03,90.17 242.03,114.24 239.43,116.84 231.14,116.84 223.52,109.22 187.96,109.22 185.42,106.68 152.4,106.68 150.15,108.93 J4.2

### Text on the board
tNames: + | ROTARY | BUZZER | SWITCH | GW | GW | LIO | KAGRA | VIRGO | LHO | LLO | GEO | TYPE | NOTIFICATION | + VOLUME -
bNames: + | SPEAKER | SPEAKER | BUTTON 1 | BUTTON 2 | DATA | BUZZ | +3.3V | - | + | +5V | GND | +5V | + | - | B1 | B2 | Christian Chapman-Bird | Steven O'Shea | Borja Sorazu | John Veitch | + | - | - | + | Gravitational Wave Alarm